# EasyEDA schematic easyeda SCH.json
TITLE: main; REV: 1.0; Date: 2026-08-19; Sheet: 1/1; Drawn By: rabieulawal.h; Company: Your Company
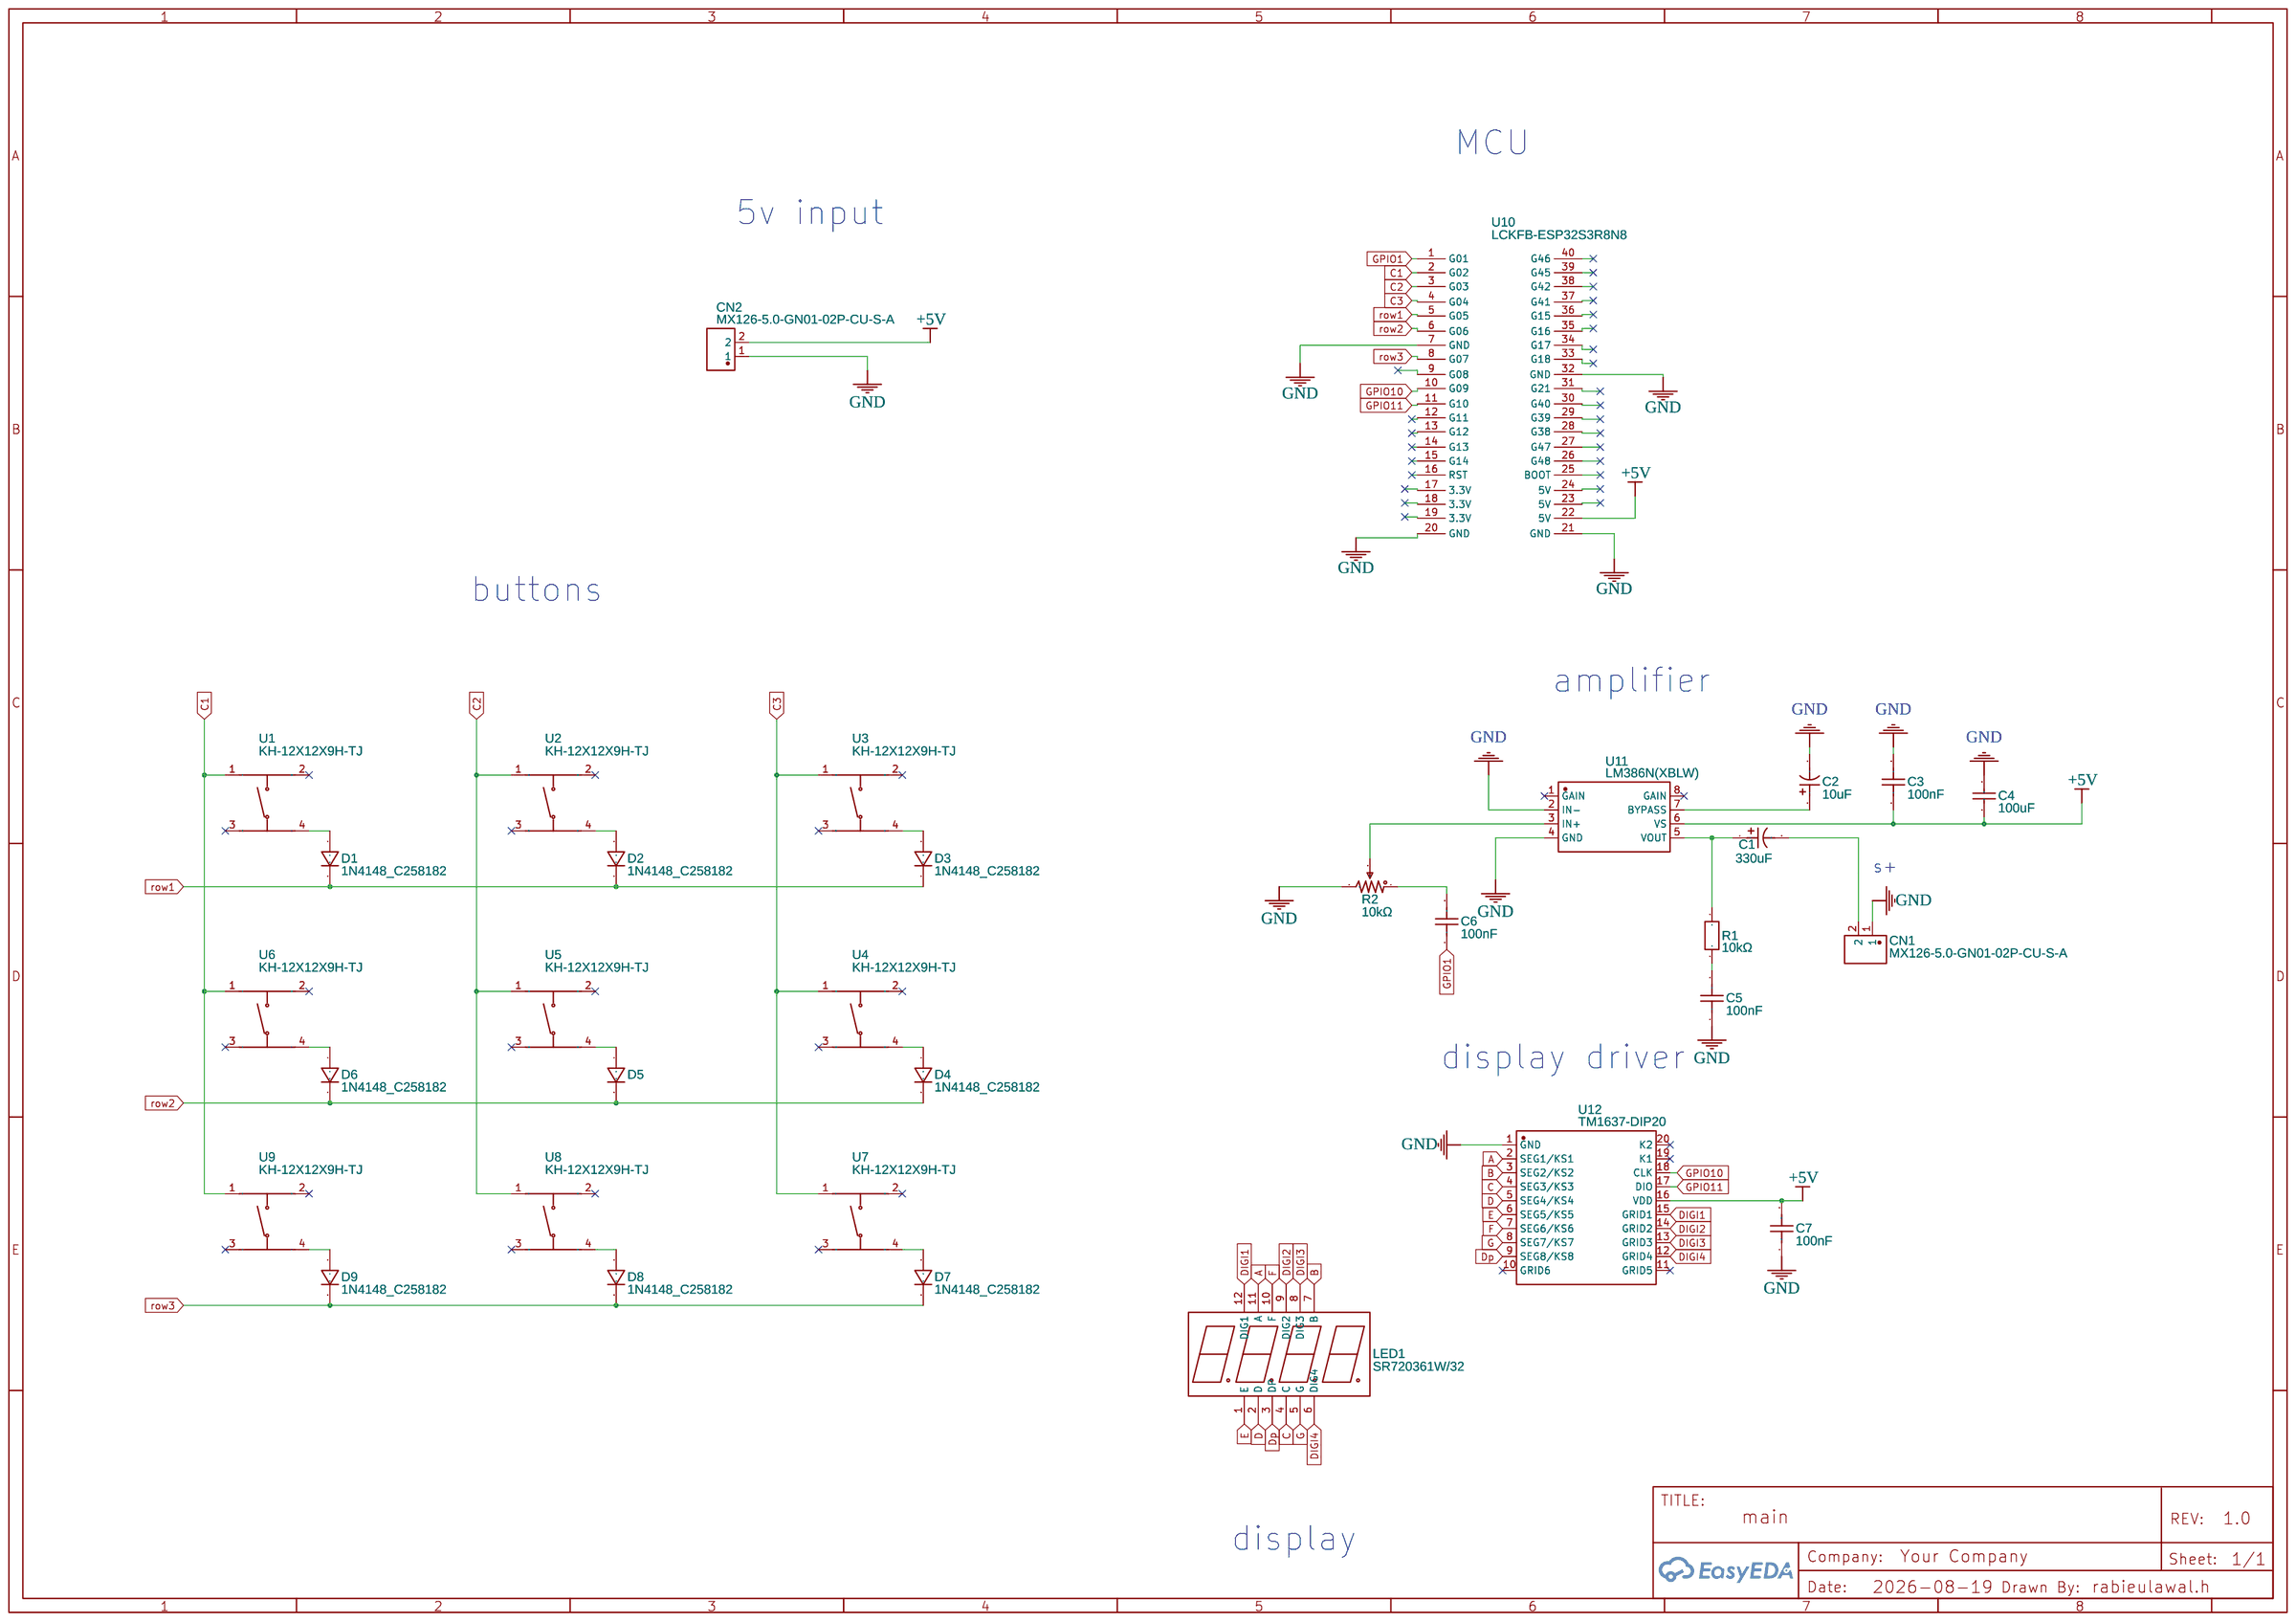
[diagram p0: schematic sheet]

## Parts
C1  330uF  [CAP-TH_BD6.3-P2.50-D0.6-FD]
C2  10uF  [CAP-TH_BD5.0-P2.00-D0.5-FD_H11.0]
C3  100nF  [C1210]
C4  100uF  [C1210]
C5  100nF  [C1210]
C6  100nF  [C1210]
C7  100nF  [C1210]
CN1  MX126-5.0-GN01-02P-CU-S-A  [CONN-TH_2P-P5.00_MX126-5.0-GN01-02P-CU-S-A]
CN2  MX126-5.0-GN01-02P-CU-S-A  [CONN-TH_2P-P5.00_MX126-5.0-GN01-02P-CU-S-A]
D1  1N4148_C258182  [DO-35_BD2.0-L4.0-P8.00-D0.5-FD]
D2  1N4148_C258182  [DO-35_BD2.0-L4.0-P8.00-D0.5-FD]
D3  1N4148_C258182  [DO-35_BD2.0-L4.0-P8.00-D0.5-FD]
D4  1N4148_C258182  [DO-35_BD2.0-L4.0-P8.00-D0.5-FD]
D5  1N4148_C258182  [DO-35_BD2.0-L4.0-P8.00-D0.5-FD]
D6  1N4148_C258182  [DO-35_BD2.0-L4.0-P8.00-D0.5-FD]
D7  1N4148_C258182  [DO-35_BD2.0-L4.0-P8.00-D0.5-FD]
D8  1N4148_C258182  [DO-35_BD2.0-L4.0-P8.00-D0.5-FD]
D9  1N4148_C258182  [DO-35_BD2.0-L4.0-P8.00-D0.5-FD]
LED1  SR720361W/32  [LED-SEG-TH_12P-L30.0-W14.0-P2.54-S10.16-BL]
R1  10kΩ  [RES-TH_BD2.3-L3.7-P7.70-D0.9]
R2  10kΩ  [RES-ADJ-TH_RK09Y11L0001]
U1  KH-12X12X9H-TJ  [SW-TH_4P-L12.0-W12.0-P5.00-LS12.5]
U2  KH-12X12X9H-TJ  [SW-TH_4P-L12.0-W12.0-P5.00-LS12.5]
U3  KH-12X12X9H-TJ  [SW-TH_4P-L12.0-W12.0-P5.00-LS12.5]
U4  KH-12X12X9H-TJ  [SW-TH_4P-L12.0-W12.0-P5.00-LS12.5]
U5  KH-12X12X9H-TJ  [SW-TH_4P-L12.0-W12.0-P5.00-LS12.5]
U6  KH-12X12X9H-TJ  [SW-TH_4P-L12.0-W12.0-P5.00-LS12.5]
U7  KH-12X12X9H-TJ  [SW-TH_4P-L12.0-W12.0-P5.00-LS12.5]
U8  KH-12X12X9H-TJ  [SW-TH_4P-L12.0-W12.0-P5.00-LS12.5]
U9  KH-12X12X9H-TJ  [SW-TH_4P-L12.0-W12.0-P5.00-LS12.5]
U10  LCKFB-ESP32S3R8N8  [DIP-40_L20.32-W51.66-P2.54-LS15.24]
U11  LM386N(XBLW)  [PDIP-8_L9.3-W6.4-P2.54-LS7.9-BL-1]
U12  TM1637-DIP20  [DIP-20_L26.0-W6.6-P2.54-LS7.6-BL]

## Library data of the parts
C1 = 330UF10V6.3X11GF: Supplier: LCSC; Supplier Part: C49304925; Manufacturer: Econd(米朗电子); Manufacturer Part: 330uF10V6.3x11GF; JLCPCB Part Class: Extended Part; Contributor: lcsc
C2 = CG100ME511BP: Supplier: LCSC; Supplier Part: C2840026; Manufacturer: TWBOR(伯鸿); JLCPCB Part Class: Extended Part; Contributor: lcsc
C3 C5-C7 = FM32X104K101EMG: Supplier: LCSC; Supplier Part: C436244; Manufacturer: PSA(信昌电陶); JLCPCB Part Class: Extended Part; Contributor: lcsc
C4 = CL32A107MQVNNNE: Supplier: LCSC; Manufacturer: SAMSUNG(三星); Supplier Part: C49066; JLCPCB Part Class: Extended Part; link: https://lcsc.com/eda_search?q=C49066&%26type=1&ref=editor
CN1 = MX126-5.0-GN01-02P-CU-S-A: Supplier: LCSC; Supplier Part: C5188434; Manufacturer: MAX(迈旭); Manufacturer Part: MX126-5.0-02P-GN01-Cu-S-A; JLCPCB Part Class: Extended Part; Contributor: lcsc
CN2 = MX126-5.0-GN01-02P-CU-S-A: Supplier: LCSC; Supplier Part: C5188434; Manufacturer: MAX(迈旭); Manufacturer Part: MX126-5.0-02P-GN01-Cu-S-A; JLCPCB Part Class: Extended Part; Contributor: lcsc; link: https://lcsc.com/eda_search?q=C5188434&%26type=1&ref=editor
D1-D9 = 1N4148_C258182: Contributor: LCSC; Supplier: LCSC; Supplier Part: C258182; Manufacturer: onsemi(安森美); Manufacturer Part: 1N4148; JLCPCB Part Class: Extended Part
LED1 = SR720361W/32: Supplier: LCSC; Supplier Part: C2980917; Manufacturer: ARKLED(方舟); JLCPCB Part Class: Extended Part; Contributor: lcsc
R1 = CR1/8W-10K±5%-ST52: Contributor: lcsc; Supplier: LCSC; Supplier Part: C2896924; Manufacturer: VO(翔胜); JLCPCB Part Class: Extended Part
R2 = RK09Y11L0001: Contributor: lcsc; Supplier: LCSC; Supplier Part: C470717; Manufacturer: ALPSALPINE(阿尔卑斯阿尔派); JLCPCB Part Class: Extended Part
U1-U9 = KH-12X12X9H-TJ: Supplier: LCSC; Supplier Part: C18186456; Manufacturer: kinghelm(金航标); Contributor: lcsc; JLCPCB Part Class: Extended Part
U10 = LCKFB-ESP32S3R8N8: Supplier: LCSC; Supplier Part: C20626143; Manufacturer: 立创开发板; Contributor: lcsc; JLCPCB Part Class: Extended Part
U11 = LM386N(XBLW): Supplier: LCSC; Supplier Part: C20612516; Manufacturer: XBLW(芯伯乐); JLCPCB Part Class: Extended Part; Contributor: lcsc
U12 = TM1637-DIP20: Supplier: LCSC; Supplier Part: C22767313; Manufacturer: TM(天微); Contributor: lcsc; JLCPCB Part Class: Extended Part

## Nets
+5V: C3.1 C4.1 C7.2 CN2.2 U10.22(5V) U11.6(VS) U12.16(VDD)
GND: C2.2 C3.2 C4.2 C5.1 C7.1 CN1.1 CN2.1 R2.3 U10.7(GND) U10.20(GND) U10.21(GND) U10.32(GND) U11.2(IN-) U11.4(GND) U12.1(GND)
A: LED1.11(A) U12.2(SEG1/KS1)
B: LED1.7(B) U12.3(SEG2/KS2)
C: LED1.4(C) U12.4(SEG3/KS3)
C1: U1.1 U6.1 U9.1 U10.2(G02)
C2: U2.1 U5.1 U8.1 U10.3(G03)
C3: U3.1 U4.1 U7.1 U10.4(G04)
D: LED1.2(D) U12.5(SEG4/KS4)
DIGI1: LED1.12(DIG1) U12.15(GRID1)
DIGI2: LED1.9(DIG2) U12.14(GRID2)
DIGI3: LED1.8(DIG3) U12.13(GRID3)
DIGI4: LED1.6(DIG4) U12.12(GRID4)
Dp: LED1.3(DP) U12.9(SEG8/KS8)
E: LED1.1(E) U12.6(SEG5/KS5)
F: LED1.10(F) U12.7(SEG6/KS6)
G: LED1.5(G) U12.8(SEG7/KS7)
GPIO1: C6.1 U10.1(G01)
GPIO10: U10.10(G09) U12.18(CLK)
GPIO11: U10.11(G10) U12.17(DIO)
row1: D1.2(K) D2.2(K) D3.2(K) U10.5(G05)
row2: D4.2(K) D5.2(K) D6.2(K) U10.6(G06)
row3: D7.2(K) D8.2(K) D9.2(K) U10.8(G07)
Net-(C1-1): C1.1 R1.2 U11.5(VOUT)
Net-(C1-2): C1.2 CN1.2
Net-(C2-1): C2.1 U11.7(BYPASS)
Net-(C5-2): C5.2 R1.1
Net-(C6-2): C6.2 R2.1
Net-(D1-1): D1.1(A) U1.4
Net-(D2-1): D2.1(A) U2.4
Net-(D3-1): D3.1(A) U3.4
Net-(D4-1): D4.1(A) U4.4
Net-(D5-1): D5.1(A) U5.4
Net-(D6-1): D6.1(A) U6.4
Net-(D7-1): D7.1(A) U7.4
Net-(D8-1): D8.1(A) U8.4
Net-(D9-1): D9.1(A) U9.4
Net-(R2-2): R2.2 U11.3(IN+)

Not connected (* = marked no-connect by the designer): U1 2* 3*; U2 2* 3*; U3 2* 3*; U4 2* 3*; U5 2* 3*; U6 2* 3*; U7 2* 3*; U8 2* 3*; U9 2* 3*; U10 9(G08) 12(G11) 13(G12) 14(G13) 15(G14) 16(RST) 17(3.3V) 18(3.3V) 19(3.3V) 23(5V) 24(5V) 25(BOOT) 26(G48) 27(G47) 28(G38) 29(G39) 30(G40) 31(G21) 33(G18) 34(G17) 35(G16) 36(G15) 37(G41) 38(G42) 39(G45) 40(G46); U11 1(GAIN)* 8(GAIN)*; U12 10(GRID6)* 11(GRID5)* 19(K1)* 20(K2)*

## Notes on the sheet
- MCU
- 5v input
- buttons
- amplifier
- s+
- display driver
- display
